# Altium project BalEv.PrjPcb
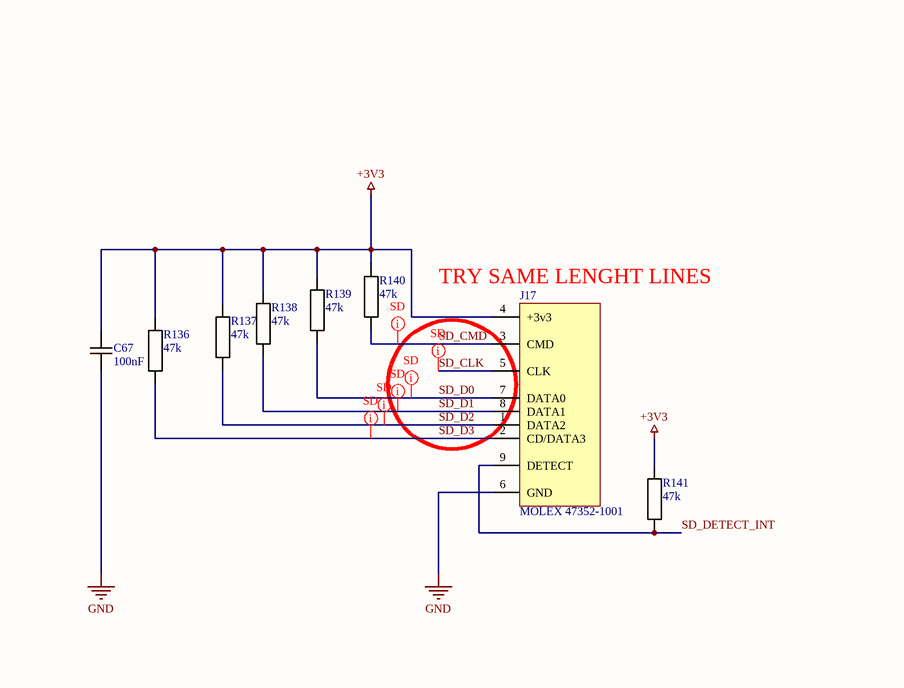
[diagram p0: BalEv_SD_card_v1_0.SchDoc]
PcbDate: 25.05.2022; PcbDesigner: gas; PcbRevision: 1.0; SchematicDate: 17.01.2022; SchematicDesigner: anx/sap; SchematicRevision: 1.0a
5 sheets, 155 parts. Net scope: global (net labels, ports and power ports of the same name join across sheets).
Board file: BalEv.PcbDoc
Sheets:
  BalEv_SD_card_v1_0.SchDoc
  BalEv_USB_v1_0.SchDoc
  BalEv_FPTG_POW_COFIG_v1_0.SchDoc
  BalEv_ADC_v1_0.SchDoc
  BalEv_Mechanic_v1_0.SchDoc

## Sheet BalEv_SD_card_v1_0.SchDoc
size A4; CompanyName: HESSO; Address1: Route du Rawyl 47; Address2: 1950 Sion; Address3: Switzerland; DocumentNumber: 5; SheetNumber: 1; SheetTotal: 8; PageSetup: Record=PageOptions|CenterHorizontal=True|CenterVertical=True|PrintScale=1.00|XCorrection=1.00|YCorrection=1.00|PrintKind=1|BorderSize=5000000|LeftOffset=0|BottomOffset=0|Orientation=2|PaperLength=1000|PaperWidth=1000|Scale=100|PaperSource=15|PrintQuality=1200|MediaType=1|DitherType=10|PrintScaleMode=1|PaperKind=A4|PaperIndex=9; ProjectName: Project Name

### Parts
C67  100nF  [CAPACITOR 1005 REFLOW]
J17  MOLEX 47352-1001  [SD MICRO MOLEX 47352-1001]
R136  47k  [RESISTOR 1005 REFLOW]
R137  47k  [RESISTOR 1005 REFLOW]
R138  47k  [RESISTOR 1005 REFLOW]
R139  47k  [RESISTOR 1005 REFLOW]
R140  47k  [RESISTOR 1005 REFLOW]
R141  47k  [RESISTOR 1005 REFLOW]

### Nets
+3V3: C67.2 J17.4(+3v3) R136.2 R137.2 R138.2 R139.2 R140.2 R141.2
GND: C67.1 J17.6(GND)
SD_CLK: J17.5(CLK)
SD_CMD: J17.3(CMD) R140.1
SD_D0: J17.7(DATA0) R139.1
SD_D1: J17.8(DATA1) R138.1
SD_D2: J17.1(DATA2) R137.1
SD_D3: J17.2(CD/DATA3) R136.1
SD_DETECT_INT: J17.9(DETECT) R141.1

### Layout directives
net class SD; rule Matched Net Lengths [Tolerance = 1mm]: SD_CLK, SD_CMD, SD_D0, SD_D1, SD_D2, SD_D3

### Notes on the sheet
- (near J17) TRY SAME LENGHT LINES
- Date :
- Revision :
- Sheet
- of
- Design by :

### Library data of the parts
C67 = Capacitor: Value: 100nF; STOCK: NO
J17 = SD-MICRO MOLEX 47352-1001: SD Card  Micro 47352-1001; Value: MOLEX 47352-1001; STOCK: YES
R136-R141 = Resistor: Value: 47k; STOCK: NO

## Sheet BalEv_USB_v1_0.SchDoc
size A4; CompanyName: HESSO; Address1: Route du Rawyl 47; Address2: 1950 Sion; Address3: Switzerland; DocumentNumber: 6; SheetNumber: 3; SheetTotal: 9; PageSetup: Record=PageOptions|CenterHorizontal=True|CenterVertical=True|PrintScale=1.00|XCorrection=1.00|YCorrection=1.00|PrintKind=1|BorderSize=5000000|LeftOffset=0|BottomOffset=0|Orientation=2|PaperLength=1000|PaperWidth=1000|Scale=100|PaperSource=15|PrintQuality=1200|MediaType=1|DitherType=10|PrintScaleMode=1|PaperKind=A4|PaperIndex=9; ProjectName: Project Name
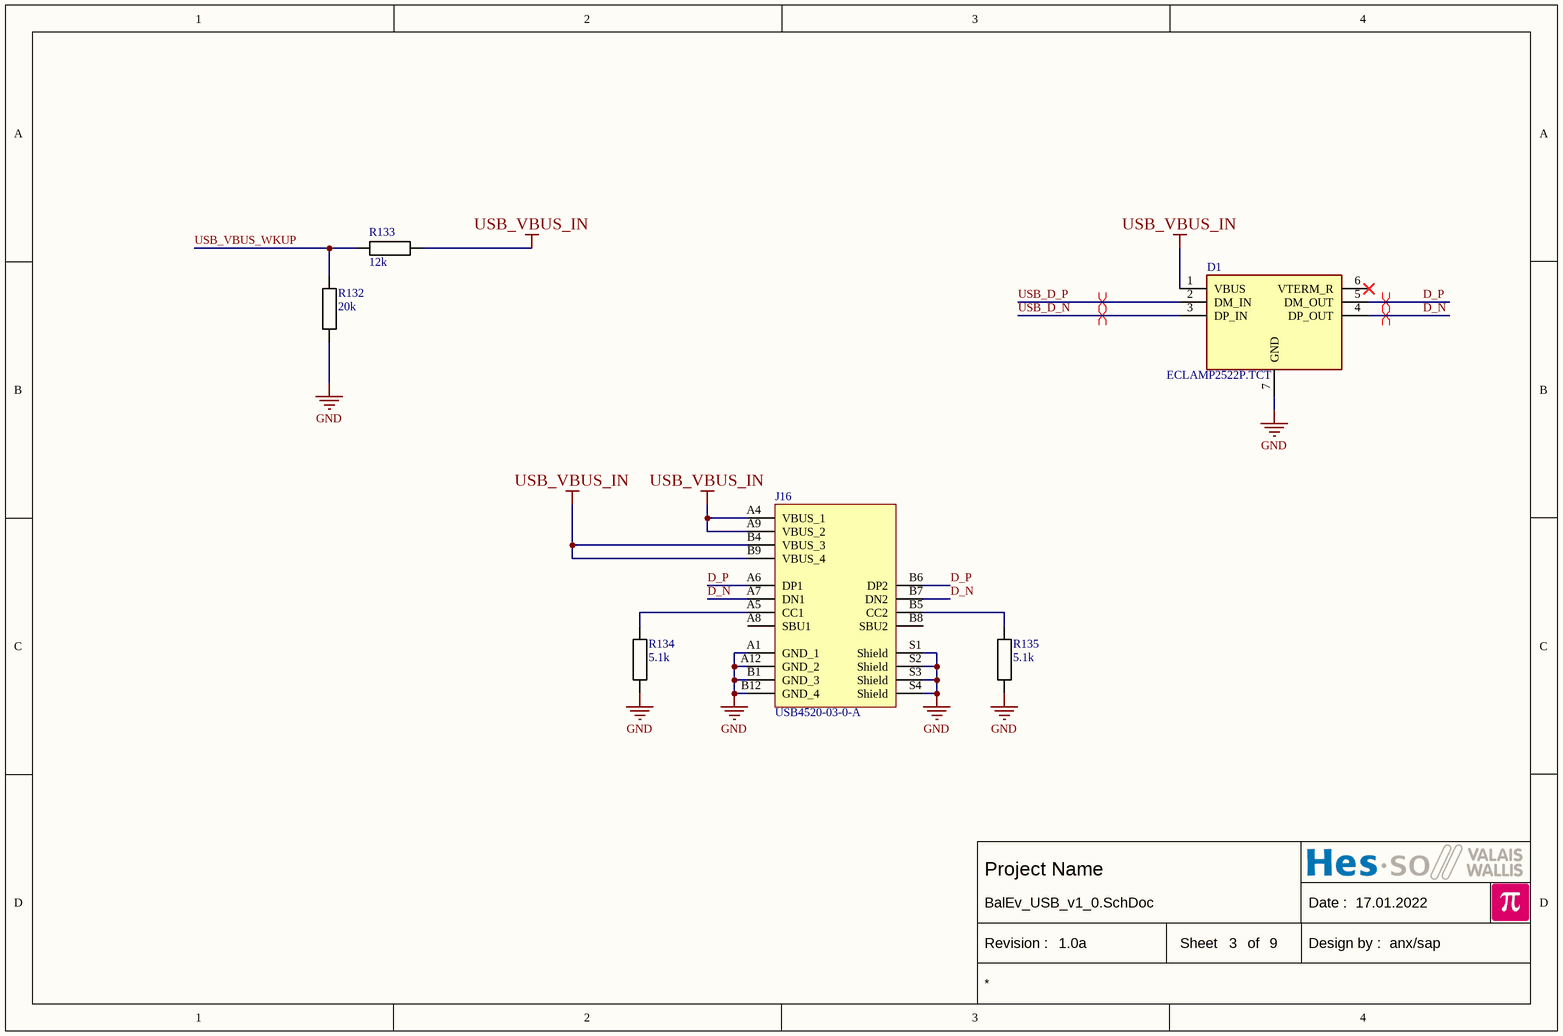
[diagram p1: BalEv_USB_v1_0.SchDoc]

### Parts
D1  ECLAMP2522P.TCT  [SON50P160X160X65-7N]
J16  USB4520-03-0-A  [USB-C-SMD GCT USB4520030A]
R132  20k  [RESISTOR 1005 REFLOW]
R133  12k  [RESISTOR 1005 REFLOW]
R134  5.1k  [RESISTOR 1005 REFLOW]
R135  5.1k  [RESISTOR 1005 REFLOW]

### Nets
GND: D1.7(GND) J16.A1(GND_1) J16.A12(GND_2) J16.B1(GND_3) J16.B12(GND_4) J16.S1(Shield) J16.S2(Shield) J16.S3(Shield) J16.S4(Shield) R132.2 R134.2 R135.2
USB_VBUS_IN: D1.1(VBUS) J16.A4(VBUS_1) J16.A9(VBUS_2) J16.B4(VBUS_3) J16.B9(VBUS_4) R133.1
D_N: D1.4(DP_OUT) J16.A7(DN1) J16.B7(DN2)
D_P: D1.5(DM_OUT) J16.A6(DP1) J16.B6(DP2)
USB_D_N: D1.3(DP_IN)
USB_D_P: D1.2(DM_IN)
USB_VBUS_WKUP: R132.1 R133.2
NetJ16_A5: J16.A5(CC1) R134.1
NetJ16_B5: J16.B5(CC2) R135.1

Not connected (* = marked no-connect by the designer): D1 6(VTERM_R)*; J16 A8(SBU1) B8(SBU2)

### Layout directives
differential pair: D_N, D_P, USB_D_N, USB_D_P

### Notes on the sheet
- Date :
- Revision :
- Sheet
- of
- Design by :

### Library data of the parts
D1 = ECLAMP2522P.___: Integrated Circuit; Value: ECLAMP2522P.TCT
J16 = USB-C SMD GTC USB4520-03-0-A: Connector; Value: USB4520-03-0-A
R132-R135 = Resistor
  R132: Value: 20k; STOCK: NO
  R133: Value: 12k; STOCK: NO
  R134 R135: Value: 5.1k

## Sheet BalEv_FPTG_POW_COFIG_v1_0.SchDoc
size A4; CompanyName: HESSO; Address1: Route du Rawyl 47; Address2: 1950 Sion; Address3: Switzerland; DocumentNumber: 5; SheetNumber: 4; SheetTotal: 9; PageSetup: Record=PageOptions|CenterHorizontal=True|CenterVertical=True|PrintScale=1.00|XCorrection=1.00|YCorrection=1.00|PrintKind=1|BorderSize=5000000|LeftOffset=0|BottomOffset=0|Orientation=2|PaperLength=1000|PaperWidth=1000|Scale=100|PaperSource=15|PrintQuality=1200|MediaType=1|DitherType=10|PrintScaleMode=1|PaperKind=A4|PaperIndex=9; ProjectName: Project Name
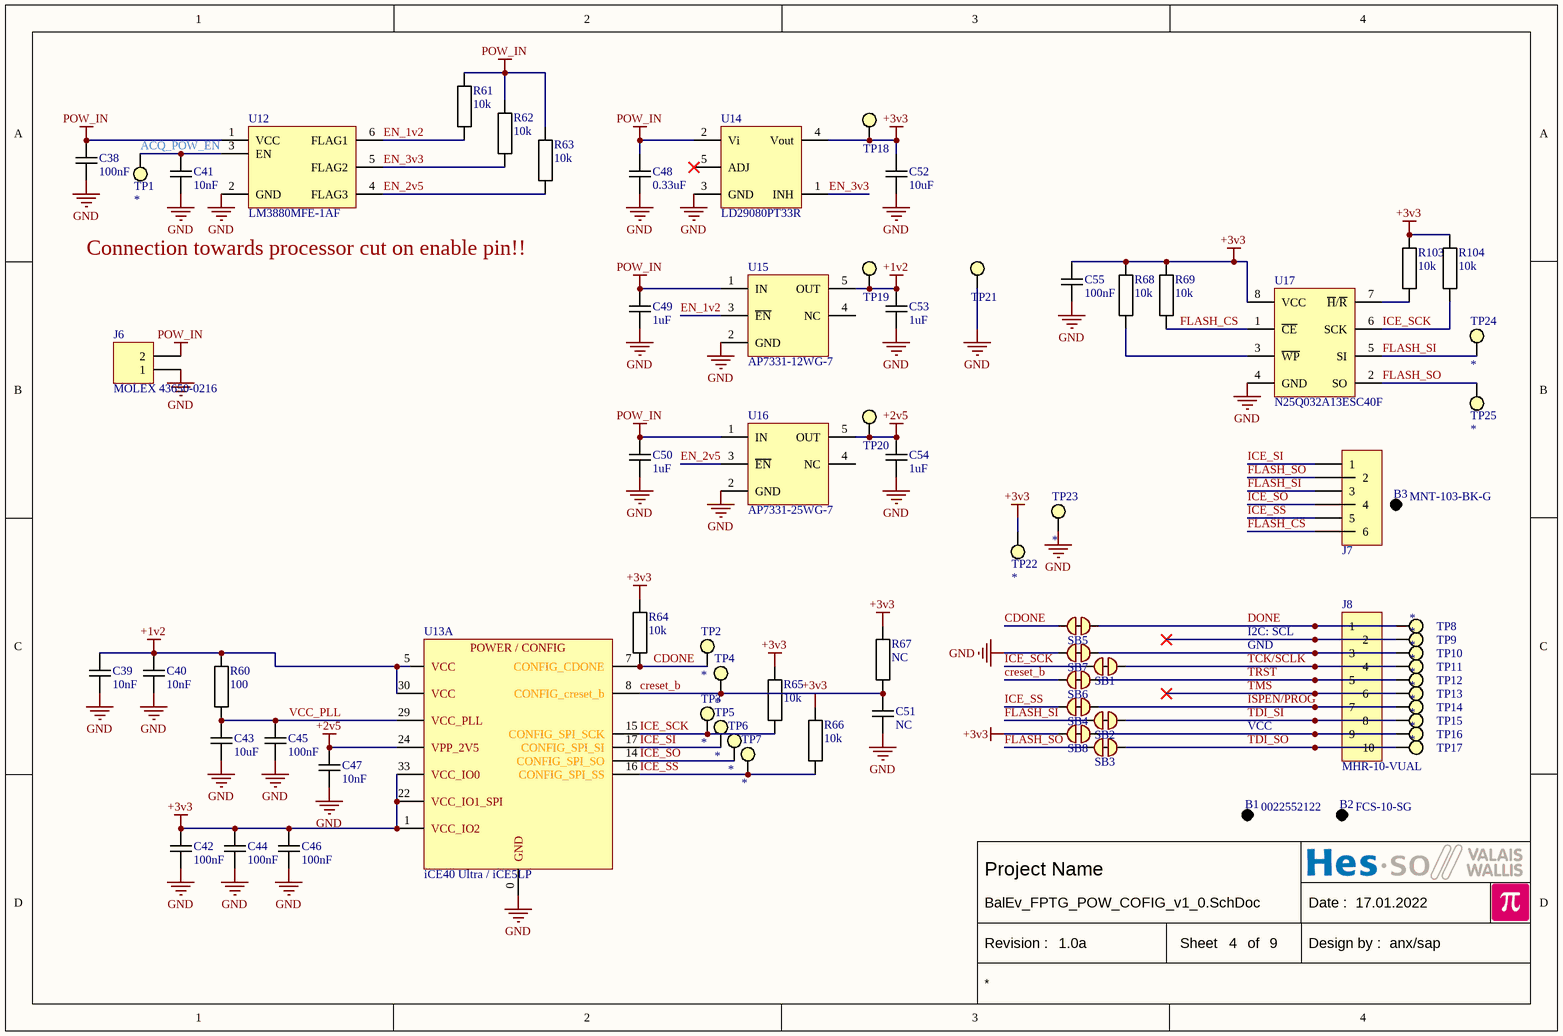
[diagram p2: BalEv_FPTG_POW_COFIG_v1_0.SchDoc]

### Parts
B1  0022552122  (mechanical)
B2  FCS-10-SG  (mechanical)
B3  MNT-103-BK-G  (mechanical)
C38  100nF  [CAPACITOR 1005 REFLOW]
C39  10nF  [CAPACITOR 1005 REFLOW]
C40  10nF  [CAPACITOR 1005 REFLOW]
C41  10nF  [CAPACITOR 1005 REFLOW]
C42  100nF  [CAPACITOR 1005 REFLOW]
C43  10uF  [CAPACITOR 1005 REFLOW]
C44  100nF  [CAPACITOR 1005 REFLOW]
C45  100nF  [CAPACITOR 1005 REFLOW]
C46  100nF  [CAPACITOR 1005 REFLOW]
C47  10nF  [CAPACITOR 1005 REFLOW]
C48  0.33uF  [CAPACITOR 1608 REFLOW]
C49  1uF  [CAPACITOR 1608 REFLOW]
C50  1uF  [CAPACITOR 1608 REFLOW]
C51  NC  [CAPACITOR 1005 REFLOW]
C52  10uF  [CAPACITOR 1608 REFLOW]
C53  1uF  [CAPACITOR 1608 REFLOW]
C54  1uF  [CAPACITOR 1608 REFLOW]
C55  100nF  [CAPACITOR 1005 REFLOW]
J6  MOLEX 43650-0216  [MOLEX 43650-0216]
J7  *  [PinHeader2x3 P2.54]  (value not drawn)
J8  MHR-10-VUAL  [FlatCable2x5 2.54MM Straight TH]
R60  100  [RESISTOR 1005 REFLOW]
R61  10k  [RESISTOR 1005 REFLOW]
R62  10k  [RESISTOR 1005 REFLOW]
R63  10k  [RESISTOR 1005 REFLOW]
R64  10k  [RESISTOR 1005 REFLOW]
R65  10k  [RESISTOR 1005 REFLOW]
R66  10k  [RESISTOR 1005 REFLOW]
R67  NC  [RESISTOR 1005 REFLOW]
R68  10k  [RESISTOR 1005 REFLOW]
R69  10k  [RESISTOR 1005 REFLOW]
R103  10k  [RESISTOR 1005 REFLOW]
R104  10k  [RESISTOR 1005 REFLOW]
SB1  *  [Solder Bridge 1mm Connected]  (value not drawn)  (net tie, no BOM)
SB2  *  [Solder Bridge 1mm Connected]  (value not drawn)  (net tie, no BOM)
SB3  *  [Solder Bridge 1mm Connected]  (value not drawn)  (net tie, no BOM)
SB4  *  [Solder Bridge 1mm Connected]  (value not drawn)  (net tie, no BOM)
SB5  *  [Solder Bridge 1mm Connected]  (value not drawn)  (net tie, no BOM)
SB6  *  [Solder Bridge 1mm Connected]  (value not drawn)  (net tie, no BOM)
SB7  *  [Solder Bridge 1mm Connected]  (value not drawn)  (net tie, no BOM)
SB8  *  [Solder Bridge 1mm Connected]  (value not drawn)  (net tie, no BOM)
TP1  *  [Hole 0.25 D0.8]  (no BOM)
TP2  *  [Hole 0.25 D0.8]  (no BOM)
TP3  *  [Hole 0.25 D0.8]  (no BOM)
TP4  *  [Hole 0.25 D0.8]  (no BOM)
TP5  *  [Hole 0.25 D0.8]  (no BOM)
TP6  *  [Hole 0.25 D0.8]  (no BOM)
TP7  *  [Hole 0.25 D0.8]  (no BOM)
TP8  *  [Hole 0.25 D0.8]  (no BOM)
TP9  *  [Hole 0.25 D0.8]  (no BOM)
TP10  *  [Hole 0.25 D0.8]  (no BOM)
TP11  *  [Hole 0.25 D0.8]  (no BOM)
TP12  *  [Hole 0.25 D0.8]  (no BOM)
TP13  *  [Hole 0.25 D0.8]  (no BOM)
TP14  *  [Hole 0.25 D0.8]  (no BOM)
TP15  *  [Hole 0.25 D0.8]  (no BOM)
TP16  *  [Hole 0.25 D0.8]  (no BOM)
TP17  *  [Hole 0.25 D0.8]  (no BOM)
TP18  *  [Test Point Keystone Miniature RED]  (value not drawn)
TP19  *  [Test Point Keystone Miniature RED]  (value not drawn)
TP20  *  [Test Point Keystone Miniature RED]  (value not drawn)
TP21  *  [Test Point Keystone Miniature BLACK]  (value not drawn)
TP22  *  [Hole 0.25 D0.8]  (no BOM)
TP23  *  [Hole 0.25 D0.8]  (no BOM)
TP24  *  [Hole 0.25 D0.8]  (no BOM)
TP25  *  [Hole 0.25 D0.8]  (no BOM)
U12  LM3880MFE-1AF  [SC70-6 P0.65 C1.4x2.2 H1.0]
U13  iCE40 Ultra / iCE5LP  [QFN50P700X700X100_HS-49N]  (part A of 4)
U14  LD29080PT33R  [TO252-5 P1.27 C6x6.6 H2.4]
U15  AP7331-12WG-7  [SOT23-5 P0.95 C1.6x3.0 H1.3]
U16  AP7331-25WG-7  [SOT23-5 P0.95 C1.6x3.0 H1.3]
U17  N25Q032A13ESC40F  [SO8 P1.27 C4.0X5.0 H1.75]

### Nets
+1v2: C39.2 C40.2 C53.2 R60.2 TP19.1 U13.5(VCC) U13.30(VCC) U15.5(OUT)
+2v5: C47.2 C54.2 TP20.1 U13.24(VPP_2V5) U16.5(OUT)
+3V3: C42.2 C44.2 C46.2 C52.2 C55.2 R64.2 R65.2 R66.2 R67.2 R68.2 R69.2 R103.2 R104.2 SB8.2 TP18.1 TP22.1 U13.1(VCC_IO2) U13.22(VCC_IO1_SPI) U13.33(VCC_IO0) U14.4(Vout) U17.8(VCC)
GND: C38.1 C39.1 C40.1 C41.1 C42.1 C43.1 C44.1 C45.1 C46.1 C47.1 C48.1 C49.1 C50.1 C51.1 C52.1 C53.1 C54.1 C55.1 J6.1 SB7.2 TP21.1 TP23.1 U12.2(GND) U13.0(GND) U14.3(GND) U15.2(GND) U16.2(GND) U17.4(GND)
POW_IN: C38.2 C48.2 C49.2 C50.2 J6.2 R61.2 R62.2 R63.2 U12.1(VCC) U14.2(Vi) U15.1(IN) U16.1(IN)
ACQ_POW_EN: C41.2 TP1.1 U12.3(EN)
CDONE: R64.1 SB5.2 TP2.1 U13.7(CONFIG_CDONE)
creset_b: C51.2 R67.1 SB6.2 TP4.1 U13.8(CONFIG_creset_b)
DONE: J8.1 SB5.1 TP8.1
EN_1v2: R61.1 U12.6(FLAG1) U15.3(~{EN})
EN_2v5: R63.1 U12.4(FLAG3) U16.3(~{EN})
EN_3v3: R62.1 U12.5(FLAG2) U14.1(INH)
FLASH_CS: J7.6 R69.1 U17.1(~{CE})
FLASH_SI: J7.3 SB2.2 TP24.1 U17.5(SI)
FLASH_SO: J7.2 SB3.2 TP25.1 U17.2(SO)
ICE_SCK: R65.1 R104.1 SB1.2 TP3.1 U13.15(CONFIG_SPI_SCK) U17.6(SCK)
ICE_SI: J7.1 TP5.1 U13.17(CONFIG_SPI_SI)
ICE_SO: J7.4 TP6.1 U13.14(CONFIG_SPI_SO)
ICE_SS: J7.5 R66.1 SB4.2 TP7.1 U13.16(CONFIG_SPI_SS)
ISPEN/PROG: J8.7 SB4.1 TP14.1
TCK/SCLK: J8.4 SB1.1 TP11.1
TDI_SI: J8.8 SB2.1 TP15.1
TDI_SO: J8.10 SB3.1 TP17.1
TMS: J8.6 TP13.1
TRST: J8.5 SB6.1 TP12.1
VCC_PLL: C43.2 C45.2 R60.1 U13.29(VCC_PLL)
NetJ8_2: J8.2 TP9.1
NetJ8_3: J8.3 SB7.1 TP10.1
NetJ8_9: J8.9 SB8.1 TP16.1
NetR68_1: R68.1 U17.3(~{WP})
NetR103_1: R103.1 U17.7(~{H}/~{R})

Not connected (* = marked no-connect by the designer): U14 5(ADJ)*; U15 4(NC); U16 4(NC)

### Notes on the sheet
- Connection towards processor cut on enable pin!!
- GND
- (near J8) I2C: SCL
- VCC
- Date :
- Revision :
- Sheet
- of
- Design by :
- (in symbol ICE5LP1K-SG48, part A) POWER / CONFIG

### Library data of the parts
B1-B3 = Bom Entry: Entry for Bom, no PCB symbol
  B1: Value: 0022552122
  B2: Value: FCS-10-SG
  B3: Value: MNT-103-BK-G
C38-C55 = Capacitor
  C38 C42 C44-C46 C55: Value: 100nF
  C39-C41 C47: Value: 10nF
  C43 C52: Value: 10uF
  C48: Value: 0.33uF
  C49 C50 C53 C54: Value: 1uF
  C51: Value: NC
J6 = MOLEX 43650-0216: Micro-Fit 3.0 Vertical Header, 3.00mm Pitch, Single Row, 2 Circuits
J7 = PinHeader2x3: Plug connector; Value: *
J8 = FlatCable2x5: FlatCable2x5 (BHR-10-VUA)
R60-R69 R103 R104 = Resistor
  R60: Value: 100
  R61-R66 R68 R69 R103 R104: Value: 10k
  R67: Value: NC
SB1-SB8 = Solderbridge Connected: Value: *
TP1-TP17 TP22-TP25 = Hole: Value: *
TP18-TP21 = Test Point: Value: *
U12 = LM3880MF-1__: Three-Rail Simple Power Supply Sequencer; Value: LM3880MFE-1AF
U13 = ICE5LP1K-SG48
U14 = LD29080: 800 mA fixed and adjustable output very low drop voltage regulator; Value: LD29080PT33R
U15 U16 = REGPOS SOT23-5 IN,GND,EN,NC,OUT: Generic Positive Voltage Regulator
  U15: Value: AP7331-12WG-7
  U16: Value: AP7331-25WG-7
U17 = IS25LP064D-JB: 32Mb Serial Flash Memory; Value: N25Q032A13ESC40F

## Sheet BalEv_ADC_v1_0.SchDoc
size A4; CompanyName: HESSO; Address1: Route du Rawyl 47; Address2: 1950 Sion; Address3: Switzerland; DocumentNumber: 3; SheetNumber: 5; SheetTotal: 8; PageSetup: Record=PageOptions|CenterHorizontal=True|CenterVertical=True|PrintScale=1.00|XCorrection=1.00|YCorrection=1.00|PrintKind=1|BorderSize=5000000|LeftOffset=0|BottomOffset=0|Orientation=2|PaperLength=1000|PaperWidth=1000|Scale=100|PaperSource=15|PrintQuality=1200|MediaType=1|DitherType=10|PrintScaleMode=1|PaperKind=A4|PaperIndex=9; ProjectName: Project Name
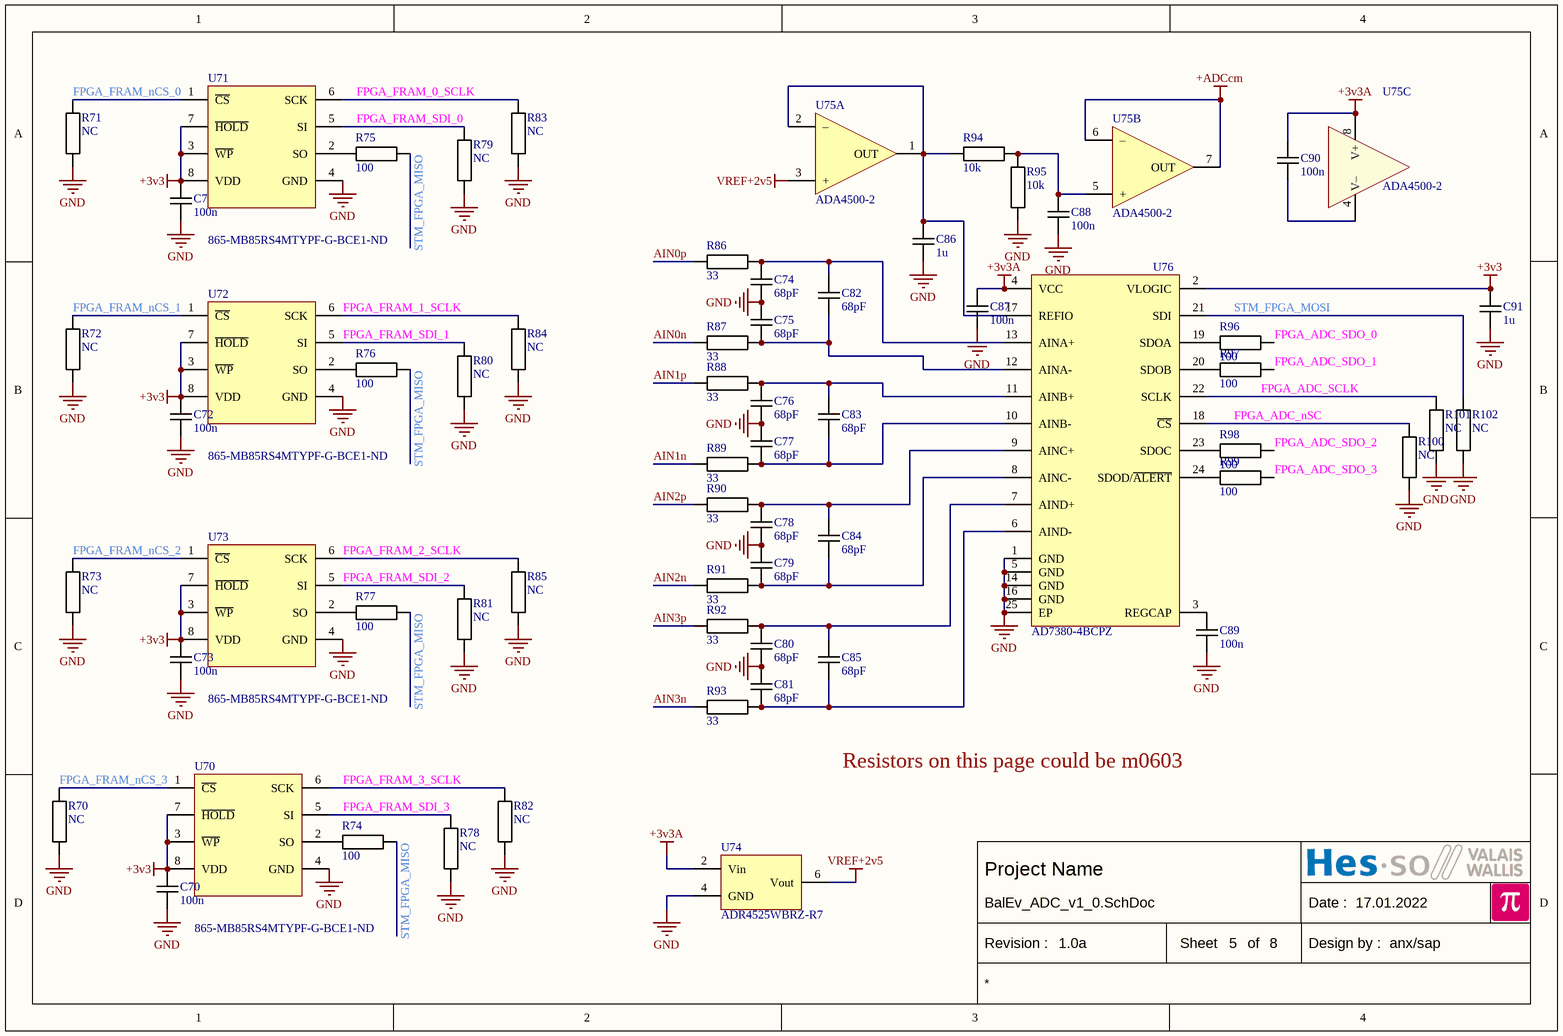
[diagram p3: BalEv_ADC_v1_0.SchDoc]

### Parts
C70  100n  [CAPACITOR 1005 REFLOW]
C71  100n  [CAPACITOR 1005 REFLOW]
C72  100n  [CAPACITOR 1005 REFLOW]
C73  100n  [CAPACITOR 1005 REFLOW]
C74  68pF  [CAPACITOR 1005 REFLOW]
C75  68pF  [CAPACITOR 1005 REFLOW]
C76  68pF  [CAPACITOR 1005 REFLOW]
C77  68pF  [CAPACITOR 1005 REFLOW]
C78  68pF  [CAPACITOR 1005 REFLOW]
C79  68pF  [CAPACITOR 1005 REFLOW]
C80  68pF  [CAPACITOR 1005 REFLOW]
C81  68pF  [CAPACITOR 1005 REFLOW]
C82  68pF  [CAPACITOR 1005 REFLOW]
C83  68pF  [CAPACITOR 1005 REFLOW]
C84  68pF  [CAPACITOR 1005 REFLOW]
C85  68pF  [CAPACITOR 1005 REFLOW]
C86  1u  [CAPACITOR 1005 REFLOW]
C87  100n  [CAPACITOR 1005 REFLOW]
C88  100n  [CAPACITOR 1005 REFLOW]
C89  100n  [CAPACITOR 1005 REFLOW]
C90  100n  [CAPACITOR 1005 REFLOW]
C91  1u  [CAPACITOR 1005 REFLOW]
R70  NC  [RESISTOR 1005 REFLOW]
R71  NC  [RESISTOR 1005 REFLOW]
R72  NC  [RESISTOR 1005 REFLOW]
R73  NC  [RESISTOR 1005 REFLOW]
R74  100  [RESISTOR 1005 REFLOW]
R75  100  [RESISTOR 1005 REFLOW]
R76  100  [RESISTOR 1005 REFLOW]
R77  100  [RESISTOR 1005 REFLOW]
R78  NC  [RESISTOR 1005 REFLOW]
R79  NC  [RESISTOR 1005 REFLOW]
R80  NC  [RESISTOR 1005 REFLOW]
R81  NC  [RESISTOR 1005 REFLOW]
R82  NC  [RESISTOR 1005 REFLOW]
R83  NC  [RESISTOR 1005 REFLOW]
R84  NC  [RESISTOR 1005 REFLOW]
R85  NC  [RESISTOR 1005 REFLOW]
R86  33  [RESISTOR 1005 REFLOW]
R87  33  [RESISTOR 1005 REFLOW]
R88  33  [RESISTOR 1005 REFLOW]
R89  33  [RESISTOR 1005 REFLOW]
R90  33  [RESISTOR 1005 REFLOW]
R91  33  [RESISTOR 1005 REFLOW]
R92  33  [RESISTOR 1005 REFLOW]
R93  33  [RESISTOR 1005 REFLOW]
R94  10k  [RESISTOR 1005 REFLOW]
R95  10k  [RESISTOR 1005 REFLOW]
R96  100  [RESISTOR 1005 REFLOW]
R97  100  [RESISTOR 1005 REFLOW]
R98  100  [RESISTOR 1005 REFLOW]
R99  100  [RESISTOR 1005 REFLOW]
R100  NC  [RESISTOR 1005 REFLOW]
R101  NC  [RESISTOR 1005 REFLOW]
R102  NC  [RESISTOR 1005 REFLOW]
U70  865-MB85RS4MTYPF-G-BCE1-ND  [SO8W P1.27 C5.0X5.0 H2.0]
U71  865-MB85RS4MTYPF-G-BCE1-ND  [SO8W P1.27 C5.0X5.0 H2.0]
U72  865-MB85RS4MTYPF-G-BCE1-ND  [SO8W P1.27 C5.0X5.0 H2.0]
U73  865-MB85RS4MTYPF-G-BCE1-ND  [SO8W P1.27 C5.0X5.0 H2.0]
U74  ADR4525WBRZ-R7  [SO8 P1.27 C4.0X5.0 H1.75]
U75  ADA4500-2  [MSOP8 P0.65 C3.0X3.0 H1.1]  (parts A,B,C of 3)
U76  AD7380-4BCPZ  [QFN24 P0.5 T0.5x0.5 C4.0x4.0 H0.6]

### Nets
+3V3: C70.2 C71.2 C72.2 C73.2 C91.2 U70.3(~{WP}) U70.7(~{HOLD}) U70.8(VDD) U71.3(~{WP}) U71.7(~{HOLD}) U71.8(VDD) U72.3(~{WP}) U72.7(~{HOLD}) U72.8(VDD) U73.3(~{WP}) U73.7(~{HOLD}) U73.8(VDD) U76.2(VLOGIC)
+3v3A: C87.2 C90.2 U74.2(Vin) U75.8(V+) U76.4(VCC)
+ADCcm: U75.6(–) U75.7(OUT)
GND: C70.1 C71.1 C72.1 C73.1 C74.2 C75.1 C76.2 C77.1 C78.2 C79.1 C80.2 C81.1 C86.1 C87.1 C88.1 C89.1 C91.1 R70.1 R71.1 R72.1 R73.1 R78.1 R79.1 R80.1 R81.1 R82.1 R83.1 R84.1 R85.1 R95.1 R100.1 R101.1 R102.1 U70.4(GND) U71.4(GND) U72.4(GND) U73.4(GND) U74.4(GND) U76.1(GND) U76.5(GND) U76.14(GND) U76.16(GND) U76.25(EP)
VREF+2v5: U74.6(Vout) U75.3(+)
AIN0n: R87.1
AIN0p: R86.1
AIN1n: R89.1
AIN1p: R88.1
AIN2n: R91.1
AIN2p: R90.1
AIN3n: R93.1
AIN3p: R92.1
FPGA_ADC_nSC: R100.2 U76.18(~{CS})
FPGA_ADC_SCLK: R101.2 U76.22(SCLK)
FPGA_ADC_SDO_0: R96.2
FPGA_ADC_SDO_1: R97.2
FPGA_ADC_SDO_2: R98.2
FPGA_ADC_SDO_3: R99.2
FPGA_FRAM_0_SCLK: R83.2 U71.6(SCK)
FPGA_FRAM_1_SCLK: R84.2 U72.6(SCK)
FPGA_FRAM_2_SCLK: R85.2 U73.6(SCK)
FPGA_FRAM_3_SCLK: R82.2 U70.6(SCK)
FPGA_FRAM_nCS_0: R71.2 U71.1(~{CS})
FPGA_FRAM_nCS_1: R72.2 U72.1(~{CS})
FPGA_FRAM_nCS_2: R73.2 U73.1(~{CS})
FPGA_FRAM_nCS_3: R70.2 U70.1(~{CS})
FPGA_FRAM_SDI_0: R79.2 U71.5(SI)
FPGA_FRAM_SDI_1: R80.2 U72.5(SI)
FPGA_FRAM_SDI_2: R81.2 U73.5(SI)
FPGA_FRAM_SDI_3: R78.2 U70.5(SI)
STM_FPGA_MISO: R74.2 R75.2 R76.2 R77.2
STM_FPGA_MOSI: R102.2 U76.21(SDI)
NetC74_1: C74.1 C82.2 R86.2 U76.13(AINA+)
NetC75_2: C75.2 C82.1 R87.2 U76.12(AINA-)
NetC76_1: C76.1 C83.2 R88.2 U76.11(AINB+)
NetC77_2: C77.2 C83.1 R89.2 U76.10(AINB-)
NetC78_1: C78.1 C84.2 R90.2 U76.9(AINC+)
NetC79_2: C79.2 C84.1 R91.2 U76.8(AINC-)
NetC80_1: C80.1 C85.2 R92.2 U76.7(AIND+)
NetC81_2: C81.2 C85.1 R93.2 U76.6(AIND-)
NetC86_2: C86.2 R94.1 U75.1(OUT) U75.2(–) U76.17(REFIO)
NetC88_2: C88.2 R94.2 R95.2 U75.5(+)
NetC89_2: C89.2 U76.3(REGCAP)
NetC90_1: C90.1 U75.4(V–)
NetR74_1: R74.1 U70.2(SO)
NetR75_1: R75.1 U71.2(SO)
NetR76_1: R76.1 U72.2(SO)
NetR77_1: R77.1 U73.2(SO)
NetR96_1: R96.1 U76.19(SDOA)
NetR97_1: R97.1 U76.20(SDOB)
NetR98_1: R98.1 U76.23(SDOC)
NetR99_1: R99.1 U76.24(SDOD/~{ALERT})

### Notes on the sheet
- Resistors on this page could be m0603
- Date :
- Revision :
- Sheet
- of
- Design by :

### Library data of the parts
C70-C91 = Capacitor
  C70-C73 C87-C90: Value: 100n
  C74-C85: Value: 68pF
  C86 C91: Value: 1u
R70-R93 R96-R102 = Resistor
  R70-R73 R78-R85 R100-R102: Value: NC
  R74-R77 R96-R99: Value: 100
  R86-R93: Value: 33
R94 R95 = Resistor: Resistor 0.01% (RNCF0603TKW10K0); Value: 10k
U70-U73 = FM25V20A-G: 2-Mbit (256 K × 8) Serial (SPI) F-RAM; Value: 865-MB85RS4MTYPF-G-BCE1-ND
U74 = ADR45___RZ (SOIC8): Ultralow Noise, High Accuracy Voltage References; Value: ADR4525WBRZ-R7
U75 = OPA DUAL: Generic dual OPA 8 pins; Value: ADA4500-2
U76 = AD7380-4BCPZ: Differential Input, Quad, External Reference / Simultaneous Sampling, 16-Bit, SAR ADC; Value: AD7380-4BCPZ

## Sheet BalEv_Mechanic_v1_0.SchDoc
size A4; SheetNumber: 9; SheetTotal: 9
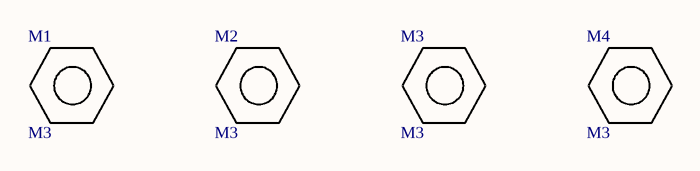
[diagram p4: BalEv_Mechanic_v1_0.SchDoc]

### Parts
M1  M3  [Nut M3 Unconnected]
M2  M3  [Nut M3 Unconnected]
M3  M3  [Nut M3 Unconnected]
M4  M3  [Nut M3 Unconnected]

### Notes on the sheet
- Date :
- Revision :
- Sheet
- of
- Design by :

### Library data of the parts
M1-M4 = Nut Unconnected: Value: M3

## Nets that join several sheets
+3V3: BalEv_SD_card_v1_0 (8 pins), BalEv_FPTG_POW_COFIG_v1_0 (21 pins), BalEv_ADC_v1_0 (18 pins)
GND: BalEv_SD_card_v1_0 (C67.1 J17.6), BalEv_USB_v1_0 (12 pins), BalEv_FPTG_POW_COFIG_v1_0 (28 pins), BalEv_ADC_v1_0 (43 pins)